# Altium schematic sheet SD_SD_WIFI.SchDoc
size 558 x 431 mm
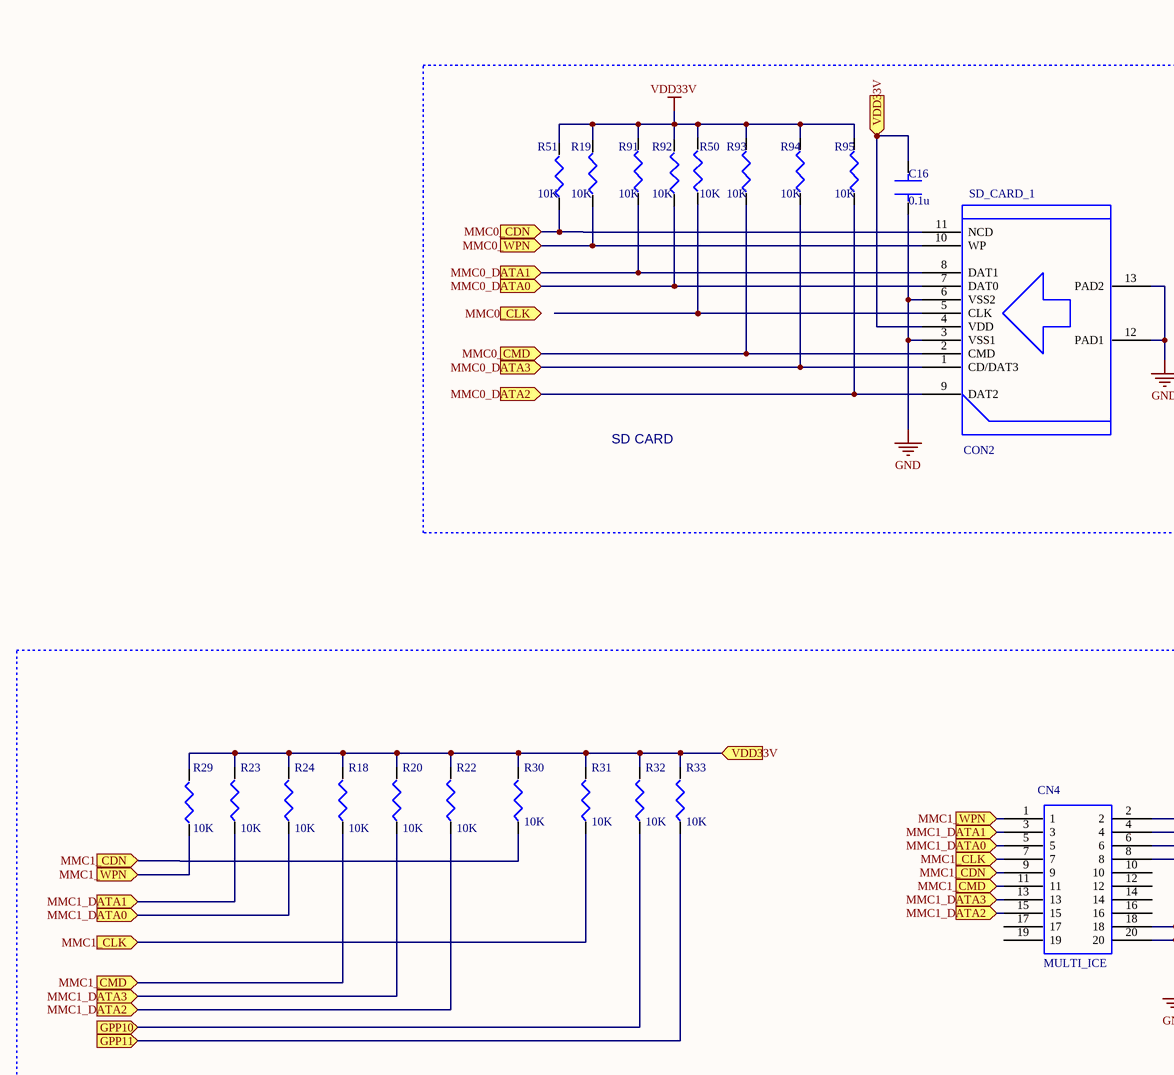
[diagram p0: SD_SD_WIFI.SchDoc, top left]
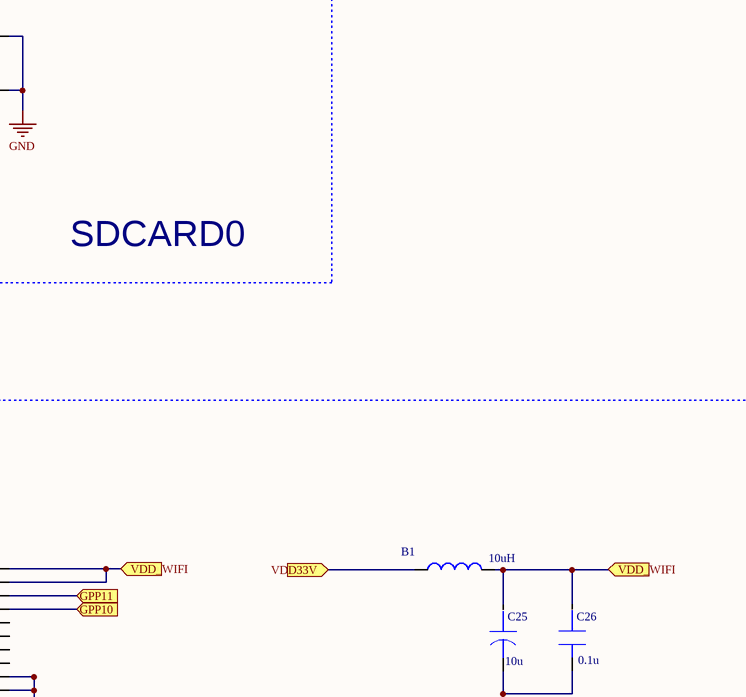
[diagram p1: SD_SD_WIFI.SchDoc, top right]
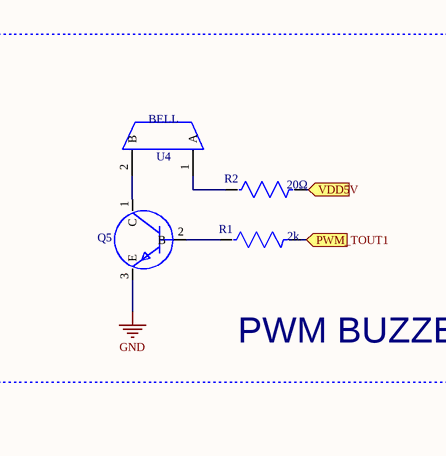
[diagram p2: SD_SD_WIFI.SchDoc, bottom left]
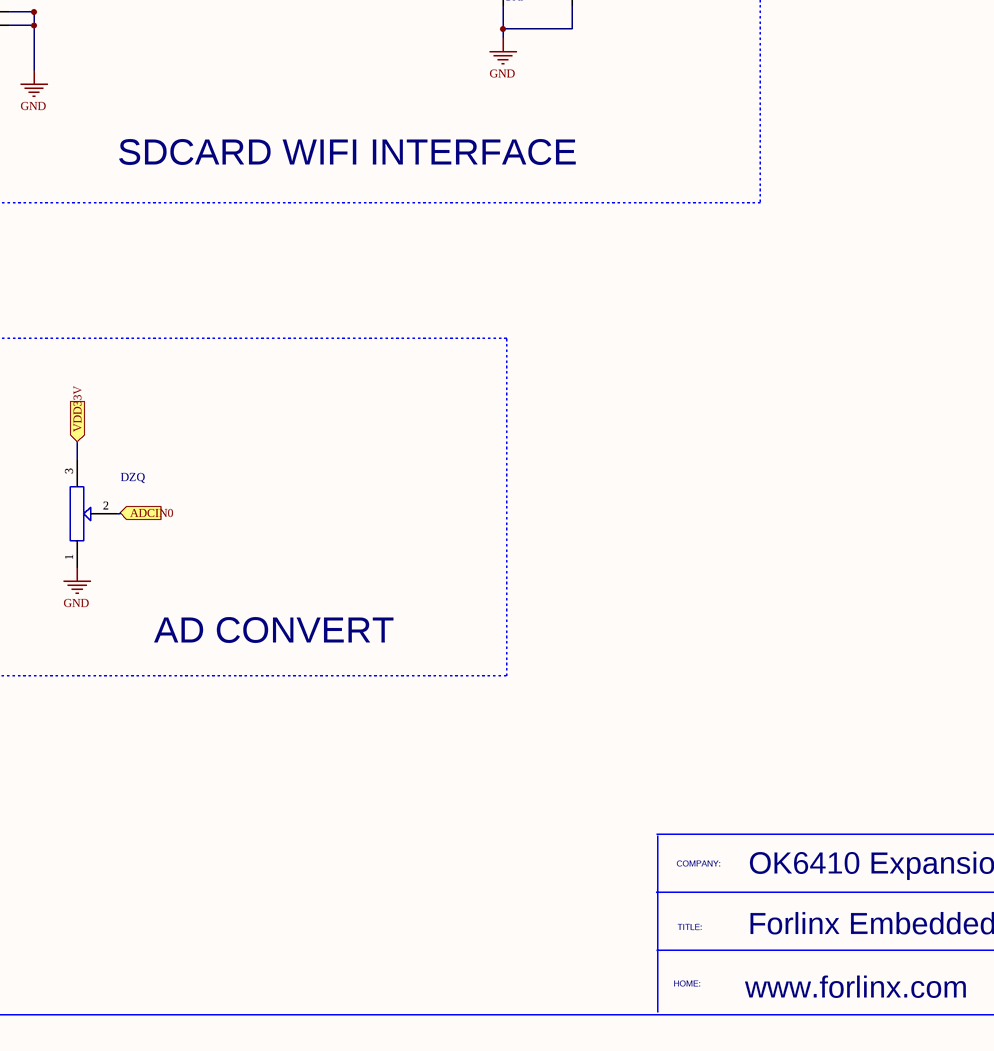
[diagram p3: SD_SD_WIFI.SchDoc, bottom right]

## Parts
B1  value 10uH  (hidden comment: INDUCTOR_0)
C16  value 0.1u  (hidden comment: CAP_0)
C25  value 10u  (hidden comment: CAP-AE4)
C26  value 0.1u  (hidden comment: CAP1206)
CN4  MULTI_ICE
CON2  SD_CARD_1
DZQ  VR  (value not drawn)
Q5  BC328NPN  (value not drawn)
R1  value 2k  (hidden comment: RES-1/4W)
R2  value 20Ω  (hidden comment: RES-1/4W)
R18  value 10K  (hidden comment: RESISTOR_2)
R19  value 10K  (hidden comment: RESISTOR_2)
R20  value 10K  (hidden comment: RESISTOR_2)
R22  value 10K  (hidden comment: RESISTOR_2)
R23  value 10K  (hidden comment: RESISTOR_2)
R24  value 10K  (hidden comment: RESISTOR_2)
R29  value 10K  (hidden comment: RESISTOR_2)
R30  value 10K  (hidden comment: RESISTOR_2)
R31  value 10K  (hidden comment: RESISTOR_2)
R32  value 10K  (hidden comment: RESISTOR_2)
R33  value 10K  (hidden comment: RESISTOR_2)
R50  value 10K  (hidden comment: RESISTOR_2)
R51  value 10K  (hidden comment: RESISTOR_2)
R91  value 10K  (hidden comment: RESISTOR_2)
R92  value 10K  (hidden comment: RESISTOR_2)
R93  value 10K  (hidden comment: RESISTOR_2)
R94  value 10K  (hidden comment: RESISTOR_2)
R95  value 10K  (hidden comment: RESISTOR_2)
U4  BELL

## Blocks framed on the sheet
SDCARD0: C16 CON2 R19 R50 R51 R91-R95
SDCARD WIFI INTERFACE: B1 C25 C26 CN4 R18 R20 R22-R24 R29-R33
PWM BUZZER: Q5 R1 R2 U4
AD CONVERT: DZQ

## Ports
ADCIN0, GPP10, GPP11, MMC0_CDN, MMC0_CLK, MMC0_CMD, MMC0_DATA0, MMC0_DATA1, MMC0_DATA2, MMC0_DATA3, MMC0_WPN, MMC1_CDN, MMC1_CLK, MMC1_CMD, MMC1_DATA0, MMC1_DATA1, MMC1_DATA2, MMC1_DATA3, MMC1_WPN, PWM_TOUT1, VDD5V, VDD33V, VDD_WIFI

## Nets
GND: C16.2 C25.2 C26.2 CN4.18 CN4.20 CON2.3(VSS1) CON2.6(VSS2) CON2.12(PAD1) CON2.13(PAD2) DZQ.1(VCC) Q5.3(E)
VDD33V: R19.2 R50.2 R51.2 R91.2 R92.2 R93.2 R94.2 R95.2
ADCIN0: DZQ.2(VCC) ; port ADCIN0
GPP10: CN4.8 R32.1 ; port GPP10
GPP11: CN4.6 R33.1 ; port GPP11
MMC0_CDN: CON2.11(NCD) R51.1 ; port MMC0_CDN
MMC0_CMD: CON2.2(CMD) R93.1 ; port MMC0_CMD
MMC0_DATA0: CON2.7(DAT0) R92.1 ; port MMC0_DATA0
MMC0_DATA1: CON2.8(DAT1) R91.1 ; port MMC0_DATA1
MMC0_DATA2: CON2.9(DAT2) R95.1 ; port MMC0_DATA2
MMC0_DATA3: CON2.1(CD/DAT3) R94.1 ; port MMC0_DATA3
MMC0_WPN: CON2.10(WP) R19.1 ; port MMC0_WPN
MMC1_CDN: CN4.9 R30.1 ; port MMC1_CDN
MMC1_CLK: CN4.7 R31.1 ; port MMC1_CLK
MMC1_CMD: CN4.11 R18.1 ; port MMC1_CMD
MMC1_DATA0: CN4.5 R24.1 ; port MMC1_DATA0
MMC1_DATA1: CN4.3 R23.1 ; port MMC1_DATA1
MMC1_DATA2: CN4.15 R22.1 ; port MMC1_DATA2
MMC1_DATA3: CN4.13 R20.1 ; port MMC1_DATA3
MMC1_WPN: CN4.1 R29.1 ; port MMC1_WPN
PWM_TOUT1: R1.2 ; port PWM_TOUT1
VDD5V: R2.2 ; port VDD5V
VDD33V: B1.1 C16.1 CON2.4(VDD) DZQ.3(VCC) R18.2 R20.2 R22.2 R23.2 R24.2 R29.2 R30.2 R31.2 R32.2 R33.2 ; port VDD33V  [a separate net that carries the same name]
VDD_WIFI: B1.2 C25.1 C26.1 CN4.2 CN4.4 ; port VDD_WIFI
NetCON2_5: CON2.5(CLK) R50.1
NetQ5_1: Q5.1(C) U4.2(B)
NetQ5_2: Q5.2(B) R1.1
NetR2_1: R2.1 U4.1(A)

Not connected (* = marked no-connect by the designer): CN4 10 12 14 16 17 19

## Notes on the sheet
- SD CARD
- COMPANY:
- TITLE:
- OK6410 Expansion Board
- HOME:
- www.forlinx.com
- Forlinx Embedded

## Library data of the parts
B1 = INDUCTOR_0: PCB DECAL: 1206
C16 = CAP_0: PCB Footprint: C2012; PCB DECAL: 0603A
C25 = CAP-AE4: ALUMINUM ELECTROLYTIC CAP.; Manufacturer #1: IPC SM-782 STD.; PCB DECAL: 3216A
C26 = CAP1206: SURFACE MOUNT CAPACITOR 0.062 X 0.126 INCHES; Manufacturer #1: IPC SM-782 STD.; PCB DECAL: 0603A
CN4 = MULTI_ICE: PCB Footprint: 3F-20PA; PCB DECAL: IDC20S
CON2 = SD_CARD_1: PCB DECAL: SD-CARD
Q5 = BC328NPN: AMPLIFIER PNP SILICON TRANSISTOR; Part Number: BC328; Manufacturer #1: MOTOROLA; PCB DECAL: SOT23T
R1 R2 = RES-1/4W: RES BODY:100  CENTERS:500; PCB DECAL: 0603A
R18-R20 R23 R24 R29-R33 R50 R51 R91-R95 = RESISTOR_2: PCB Footprint: C2012; PCB DECAL: 0603A
R22 = RESISTOR_2: PCB Footprint: C2012; Source Path: C:\WINDOW\GENERAL\2400\SCHEM\2400\SMDK2400-72F.DSN; PCB DECAL: 0603A
U4 = BELL: PCB DECAL: BELL